# Altium schematic sheet MPPT_V1.0.1_Charger_Converter.SchDoc: MPPT_V1.0
size A4; DrawnBy: Hugo Boyce; Engineer: Hugo Boyce; Organization: Altium Limited; Address1: L3, 12a Rodborough Rd; Address2: Frenchs Forest; Address3: NSW; Address4: Australia 2086; SheetNumber: 5; SheetTotal: 5
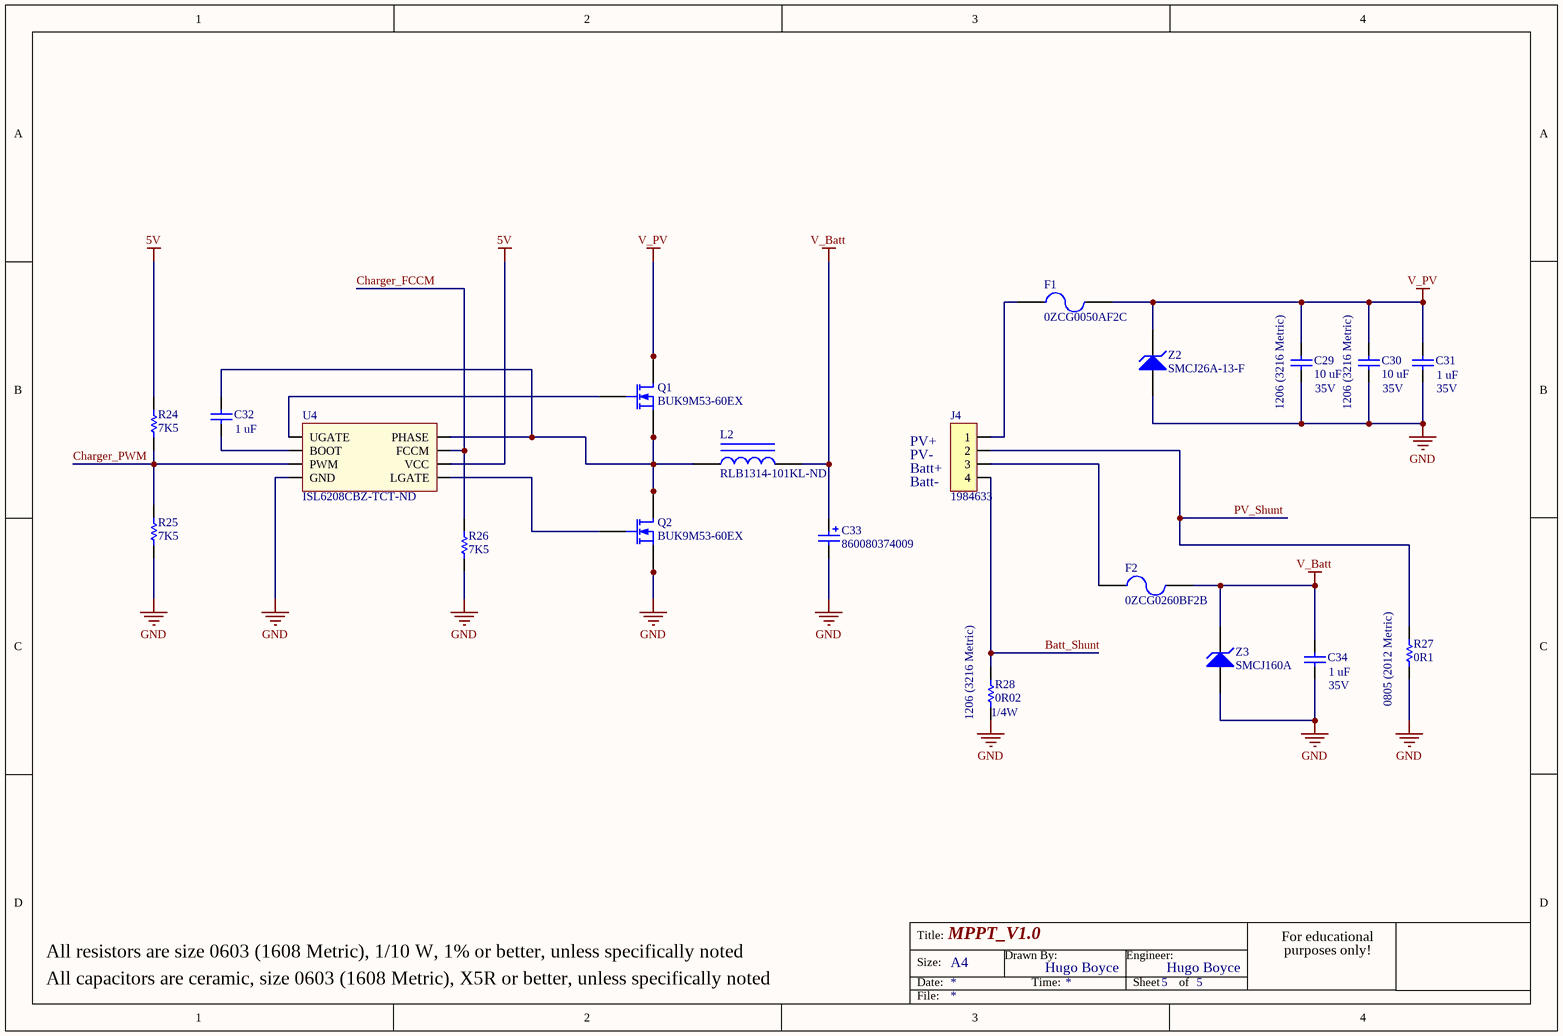
[diagram p0: MPPT_V1.0.1_Charger_Converter.SchDoc]

## Parts
C29  value 10 uF  Size: 1206 (3216 Metric)  Voltage rating: 35V  [CAPC3216N]  (hidden comment: Cap SMD)
C30  value 10 uF  Size: 1206 (3216 Metric)  Voltage rating: 35V  [CAPC3216N]  (hidden comment: Cap SMD)
C31  value 1 uF  Voltage Rating: 35V  [CAPC1608N]  (hidden comment: Cap SMD)
C32  value 1 uF  [CAPC1608N]  (hidden comment: Cap SMD)
C33  860080374009  [860080374009]
C34  value 1 uF  Voltage Rating: 35V  [CAPC1608N]  (hidden comment: Cap SMD)
F1  0ZCG0050AF2C  [OZCG0_BEL_FUSE]
F2  0ZCG0260BF2B  [OZCG0_BEL_FUSE]
J4  1984633  [1984633]
L2  Supplier Part Number 1: RLB1314-101KL-ND  [BOURNS_RLB1314]  (hidden comment: RLB1314-101KL)
Q1  BUK9M53-60EX  [BUK9M53-60E]
Q2  BUK9M53-60EX  [BUK9M53-60E]
R24  value 7K5  [RESC1608N]  (hidden comment: Res SMD)
R25  value 7K5  [RESC1608N]  (hidden comment: Res SMD)
R26  value 7K5  [RESC1608N]  (hidden comment: Res SMD)
R27  value 0R1  Size: 0805 (2012 Metric)  [RESC2012N]  (hidden comment: Res SMD)
R28  value 0R02  Size: 1206 (3216 Metric)  Power Rating: 1/4W  [RESC3216N]  (hidden comment: Res SMD)
U4  Supplier Part Number 1: ISL6208CBZ-TCT-ND  [ISL6208CBZ-T]  (hidden comment: ISL6208CBZ-T)
Z2  SMCJ26A-13-F  [SMCJxxx]
Z3  SMCJ160A  [SMCJxxx]

## Nets
5V: R24.2 U4.6(VCC)
GND: C29.2 C30.2 C31.1 C33.1 C34.1 Q2.1(S) Q2.2(S) Q2.3(S) R25.1 R26.1 R27.2 R28.1 U4.4(GND) Z2.2(A) Z3.2(A)
V_Batt: C33.2 C34.2 F2.2 L2.2 Z3.1(K)
V_PV: C29.1 C30.1 C31.2 F1.2 Q1.5(D) Q1.6(D) Q1.7(D) Q1.8(D) Z2.1(K)
Batt_Shunt: J4.4 R28.2
Charger_FCCM: R26.2 U4.7(FCCM)
Charger_PWM: R24.1 R25.2 U4.3(PWM)
PV_Shunt: J4.2 R27.1
NetC32_1: C32.1 U4.2(BOOT)
NetC32_2: C32.2 L2.1 Q1.1(S) Q1.2(S) Q1.3(S) Q2.5(D) Q2.6(D) Q2.7(D) Q2.8(D) U4.8(PHASE)
NetF1_1: F1.1 J4.1
NetF2_1: F2.1 J4.3
NetQ1_4: Q1.4(G) U4.1(UGATE)
NetQ2_4: Q2.4(G) U4.5(LGATE)

## Notes on the sheet
- (near J4) PV+
- (near J4) PV-
- (near J4) Batt+
- (near J4) Batt-
- All resistors are size 0603 (1608 Metric), 1/10 W, 1% or better, unless specifically noted
- All capacitors are ceramic, size 0603 (1608 Metric), X5R or better, unless specifically noted
- Title:
- Size:
- Date:
- A4
- Drawn By:
- Time:
- Engineer:
- Sheet
- of
- For educational
- purposes only!
- File:

## Library data of the parts
C29-C32 C34 = Cap SMD: Capacitor; Published: 8-Jun-2000; LatestRevisionDate: 17-Jul-2002; LatestRevisionNote: Re-released for DXP Platform.; PackageReference: RAD-0.3; Publisher: Altium Limited; PackageDescription: Radial Cap, Thru-Hole; 2 Leads; 0.3 in Pin Spacing
C33 = 860080374009: CAP ALUM 220UF 20% 16V THRU HOLE; Manufacturer: Wurth Electronics Inc.; Lifetime @ Temp.: 3000 Hrs @ 105°C; Polarization: Polar; Supplier 1: Digi-Key; RoHS: RoHS Compliant; Category: Capacitors; Stock 1: 716; Pricing 1: 1=0.33, 50=0.276, 100=0.2403, 250=0.21424 (CAD); Packaging: Cut Tape (CT); Part Status: Active; Tolerance: ±20%; ESR (Equivalent Series Resistance): -; Operating Temperature: -55°C ~ 105°C; Ratings: -; Applications: General Purpose; Lead Spacing: 0.138" (3.50mm); Size / Dimension: 0.315" Dia (8.00mm); Height - Seated (Max): 0.512" (13.00mm); Surface Mount Land Size: -; Mounting Type: Through Hole; Package / Case: Radial, Can; ComponentLink1URL: http://katalog.we-online.de/pbs/datasheet/860080374009.pdf; ComponentLink1Description: http://katalog.we-online.de/pbs/datasheet/860080374009.pdf; Supplier Part Number 1: 732-8997-1-ND; Manufacturer Part Number: 860080374009
F1 = 0ZCG0050AF2C: PTC RESET FUSE 30V 500MA 1812; Manufacturer: Bel Fuse Inc.; Type: Polymeric; Approvals: cURus, TUV; Supplier 1: Digi-Key; RoHS: RoHS Compliant; Category: Circuit Protection; Stock 1: 287653; Pricing 1: 1=0.19, 5=0.186, 10=0.18, 50=0.1598, 100=0.1488, 250=0.13232, 500=0.11026, 1000=0.10475 (CAD); Packaging: Cut Tape (CT); Part Status: Active; Voltage - Max: 30V; Operating Temperature: -40°C ~ 85°C; Ratings: -; Mounting Type: Surface Mount; Package / Case: 1812 (4532 Metric), Concave; Size / Dimension: 0.179" L x 0.128" W (4.55mm x 3.24mm); Height - Seated (Max): -; Thickness (Max): 0.030" (0.75mm); Lead Spacing: -; ComponentLink1URL: https://www.belfuse.com/resources/CircuitProtection/datasheets/0ZCG%20Nov2016.pdf; ComponentLink1Description: https://www.belfuse.com/resources/CircuitProtection/datasheets/0ZCG%20Nov2016.pdf; Supplier Part Number 1: 507-1762-1-ND; Manufacturer Part Number: 0ZCG0050AF2C
F2 = 0ZCG0260BF2B: PTC RESET FUSE 16V 2.6A 1812; Manufacturer: Bel Fuse Inc.; Type: Polymeric; Approvals: cURus, TUV; Supplier 1: Digi-Key; RoHS: RoHS Compliant; Category: Circuit Protection; Stock 1: 58933; Pricing 1: 1=0.39, 5=0.376, 10=0.358, 50=0.3196, 100=0.2977, 250=0.26464, 500=0.22052 (CAD); Packaging: Cut Tape (CT); Part Status: Active; Voltage - Max: 16V; Operating Temperature: -40°C ~ 85°C; Ratings: -; Mounting Type: Surface Mount; Package / Case: 1812 (4532 Metric), Concave; Size / Dimension: 0.179" L x 0.128" W (4.55mm x 3.24mm); Height - Seated (Max): -; Thickness (Max): 0.061" (1.55mm); Lead Spacing: -; ComponentLink1URL: https://www.belfuse.com/resources/CircuitProtection/datasheets/0ZCG%20Nov2016.pdf; ComponentLink1Description: https://www.belfuse.com/resources/CircuitProtection/datasheets/0ZCG%20Nov2016.pdf; Supplier Part Number 1: 507-1780-1-ND; Manufacturer Part Number: 0ZCG0260BF2B
J4 = 1984633: CONN TERM BLOCK T/H 4POS 3.5MM; Manufacturer: Phoenix Contact; Positions Per Level: 4; Pitch: 0.138" (3.50mm); Mating Orientation: Horizontal with Board; Wire Gauge: 16-26 AWG; Wire Termination: Screw; Torque - Screw: 0.22-0.25 Nm (1.9-2.2 Lb-In); Screw Thread: M2; Supplier 1: Digi-Key; RoHS: RoHS Compliant; Category: Connectors, Interconnects; Stock 1: 4509; Pricing 1: 1=1.24, 10=1.185, 50=1.133, 100=1.1021, 250=1.03, 500=0.94762, 1000=0.87551 (CAD); Packaging: Bulk; Part Status: Active; Mounting Type: Through Hole; Features: Interlocking (Side); Color: Green; Operating Temperature: -; Housing Material: Polyamide (PA), Nylon; Contact Material - Plating: -; Clamp Material - Plating: -; Screw Material - Plating: -; ComponentLink1URL: https://media.digikey.com/pdf/Data%20Sheets/Phoenix%20Contact%20PDFs/Combicon%20Compact%20Series.pdf; ComponentLink1Description: https://media.digikey.com/pdf/Data%20Sheets/Phoenix%20Contact%20PDFs/Combicon%20Compact%20Series.pdf; Supplier Part Number 1: 277-1860-ND; Manufacturer Part Number: 1984633
L2 = RLB1314-101KL: FIXED IND 100UH 1A 120 MOHM TH; Manufacturer: Bourns Inc.; Type: Wirewound; Material - Core: Ferrite; Tolerance: ±10%; Shielding: Unshielded; DC Resistance (DCR): 120 mOhm Max; Q @ Freq: 70 @ 796kHz; Supplier 1: Digi-Key; Manufacturer Part Number: RLB1314-101KL; RoHS: RoHS Compliant; Category: Inductors, Coils, Chokes; Stock 1: 2475; Pricing 1: 1=0.74, 10=0.654, 100=0.467, 500=0.39228, 1000=0.31756, 2500=0.29888 (CAD); Packaging: Bulk; Part Status: Active; Ratings: -; Operating Temperature: -40°C ~ 105°C; Mounting Type: Through Hole; Package / Case: Radial; Supplier Device Package: -; Size / Dimension: 0.461" Dia (11.70mm); Height - Seated (Max): 0.512" (13.00mm); ComponentLink1URL: http://www.bourns.com/docs/Product-Datasheets/rlb.pdf; ComponentLink1Description: http://www.bourns.com/docs/Product-Datasheets/rlb.pdf
Q1 Q2 = BUK9M53-60EX: MOSFET N-CH 60V 17A LFPAK; Manufacturer: Nexperia USA Inc.; FET Type: N-Channel; Current - Continuous Drain (Id) @ 25°C: 17A (Tc); Drive Voltage (Max Rds On,  Min Rds On): 5V; Vgs(th) (Max) @ Id: 2.1V @ 1mA; Vgs (Max): ±10V; Power Dissipation (Max): 36W (Tc); Rds On (Max) @ Id, Vgs: 46 mOhm @ 5A, 10V; Supplier 1: Digi-Key; RoHS: RoHS Compliant; Category: Discrete Semiconductor Products; Stock 1: 481; Pricing 1: 1=0.73, 10=0.61, 100=0.4575, 500=0.33548 (CAD); Packaging: Cut Tape (CT); Part Status: Active; Technology: MOSFET (Metal Oxide); FET Feature: -; Operating Temperature: -55°C ~ 175°C (TJ); Mounting Type: Surface Mount; Supplier Device Package: LFPAK33; Package / Case: SOT-1210, 8-LFPAK33 (5-Lead); ComponentLink1URL: https://assets.nexperia.com/documents/data-sheet/BUK9M53-60E.pdf; ComponentLink1Description: https://assets.nexperia.com/documents/data-sheet/BUK9M53-60E.pdf; Supplier Part Number 1: 1727-2583-1-ND; Manufacturer Part Number: BUK9M53-60EX
R24-R28 = Res SMD: Resistor; Published: 8-Jun-2000; LatestRevisionDate: 17-Jul-2002; LatestRevisionNote: Re-released for DXP Platform.; PackageReference: AXIAL-0.3; Publisher: Altium Limited; PackageDescription: Axial Device, Thru-Hole; 2 Leads; 0.3 in Pin Spacing
U4 = ISL6208CBZ-T: IC MOSFET DRVR SYNC BUCK 8-SOIC; Manufacturer: Intersil; Driven Configuration: Half-Bridge; Channel Type: Synchronous; Gate Type: N-Channel MOSFET; Voltage - Supply: 4.5 V ~ 5.5 V; Logic Voltage - VIL, VIH: 0.5V, 2V; Current - Peak Output (Source, Sink): 2A, 2A; Input Type: Non-Inverting; Rise / Fall Time (Typ): 8ns, 8ns; Supplier 1: Digi-Key; Manufacturer Part Number: ISL6208CBZ-T; RoHS: RoHS Compliant; Category: Integrated Circuits (ICs); Stock 1: 1957; Pricing 1: 1=2.62, 10=2.355, 100=1.893, 500=1.55528, 1000=1.28866 (CAD); Packaging: Cut Tape (CT); Part Status: Active; Operating Temperature: -10°C ~ 125°C (TJ); Mounting Type: Surface Mount; Package / Case: 8-SOIC (0.154", 3.90mm Width); Supplier Device Package: 8-SOIC; Base Part Number: ISL6208; ComponentLink1URL: http://www.intersil.com/content/dam/intersil/documents/isl6/isl6208-b.pdf; ComponentLink1Description: http://www.intersil.com/content/dam/intersil/documents/isl6/isl6208-b.pdf
Z2 = SMCJ26A-13-F: TVS DIODE 26VWM 42.1VC SMC; Manufacturer: Diodes Incorporated; Voltage - Reverse Standoff (Typ): 26V; Voltage - Breakdown (Min): 28.9V; Voltage - Clamping (Max) @ Ipp: 42.1V; Current - Peak Pulse (10/1000µs): 35.6A; Power - Peak Pulse: 1500W (1.5kW); Power Line Protection: No; Supplier 1: Digi-Key; RoHS: RoHS Compliant; Category: Circuit Protection; Stock 1: 3205; Pricing 1: 1=0.88, 10=0.77, 100=0.5905, 500=0.4668, 1000=0.37344 (CAD); Packaging: Cut Tape (CT); Part Status: Active; Type: Zener; Applications: General Purpose; Capacitance @ Frequency: -; Operating Temperature: -55°C ~ 150°C (TJ); Mounting Type: Surface Mount; Package / Case: DO-214AB, SMC; Supplier Device Package: SMC; Base Part Number: SMCJ26; ComponentLink1URL: https://www.diodes.com/assets/Datasheets/ds19003.pdf; ComponentLink1Description: https://www.diodes.com/assets/Datasheets/ds19003.pdf; Supplier Part Number 1: SMCJ26A-FDICT-ND; Manufacturer Part Number: SMCJ26A-13-F
Z3 = SMCJ160A: TVS DIODE 160VWM 259VC SMC; Manufacturer: ON Semiconductor; Voltage - Reverse Standoff (Typ): 160V; Voltage - Breakdown (Min): 178V; Voltage - Clamping (Max) @ Ipp: 259V; Current - Peak Pulse (10/1000µs): 5.8A; Power - Peak Pulse: 1500W (1.5kW); Power Line Protection: No; Supplier 1: Digi-Key; Manufacturer Part Number: SMCJ160A; RoHS: RoHS Compliant; Category: Circuit Protection; Stock 1: 16752; Pricing 1: 1=0.84, 10=0.732, 100=0.561, 500=0.44352, 1000=0.35481 (CAD); Packaging: Cut Tape (CT); Part Status: Active; Type: Zener; Applications: General Purpose; Capacitance @ Frequency: -; Operating Temperature: -; Mounting Type: Surface Mount; Package / Case: DO-214AB, SMC; Supplier Device Package: SMC (DO-214AB); Base Part Number: SMCJ160; ComponentLink1URL: https://www.fairchildsemi.com/datasheets/SM/SMCJ100A.pdf; ComponentLink1Description: https://www.fairchildsemi.com/datasheets/SM/SMCJ100A.pdf; Supplier Part Number 1: SMCJ160AFSCT-ND